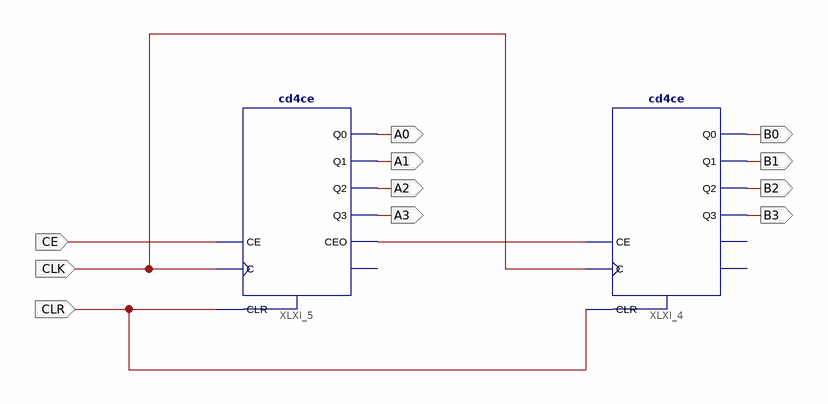
[diagram p0: schematic sheet 1]
// Xilinx ISE schematic Minute.sch (spartan6) as structural Verilog: 2 symbols, 11 ports
module Minute (
  input  CLK,
  input  CLR,
  input  CE,
  output A0,
  output A1,
  output A2,
  output A3,
  output B0,
  output B1,
  output B2,
  output B3
);

  wire XLXN_6;

  cd4ce XLXI_4 (.C(CLK), .CE(XLXN_6), .CLR(CLR), .Q0(B0), .Q1(B1), .Q2(B2), .Q3(B3));  // open: CEO, TC
  cd4ce XLXI_5 (.C(CLK), .CE(CE), .CLR(CLR), .CEO(XLXN_6), .Q0(A0), .Q1(A1), .Q2(A2), .Q3(A3));  // open: TC
endmodule
